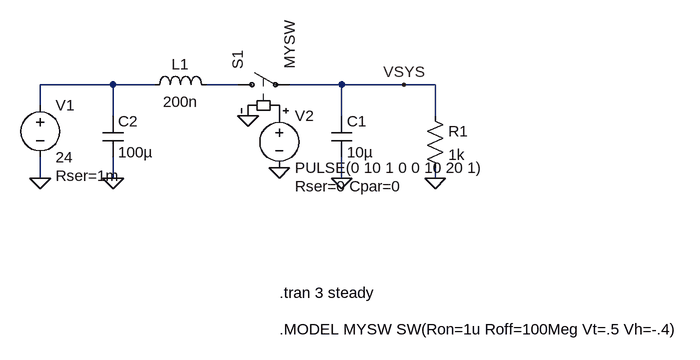
[diagram p0: schematic Draft1.asc]
Draft1.asc, the LTspice schematic file:
Version 4
SHEET 1 896 680
WIRE -16 112 -128 112
WIRE 48 112 -16 112
WIRE 176 112 128 112
WIRE 336 112 256 112
WIRE 432 112 336 112
WIRE 480 112 432 112
WIRE -128 144 -128 112
WIRE -16 160 -16 112
WIRE 336 160 336 112
WIRE 480 160 480 112
WIRE -128 256 -128 224
WIRE -16 256 -16 224
WIRE 336 256 336 224
WIRE 480 256 480 240
FLAG 336 256 0
FLAG -16 256 0
FLAG 480 256 0
FLAG -128 256 0
FLAG 192 160 0
FLAG 240 240 0
FLAG 432 112 VSYS
SYMBOL ind 32 128 R270
WINDOW 0 32 56 VTop 2
WINDOW 3 5 56 VBottom 2
SYMATTR InstName L1
SYMATTR Value 200n
SYMATTR SpiceLine Ipk=200 Rser=0.5m Rpar=0 Cpar=0
SYMBOL cap 320 160 R0
SYMATTR InstName C1
SYMATTR Value 10µ
SYMATTR SpiceLine V=25 Rser=1m
SYMBOL cap -32 160 R0
SYMATTR InstName C2
SYMATTR Value 100µ
SYMATTR SpiceLine V=25 Rser=1m
SYMBOL res 464 144 R0
SYMATTR InstName R1
SYMATTR Value 1k
SYMBOL voltage -128 128 R0
WINDOW 123 0 0 Left 0
WINDOW 39 24 124 Left 2
SYMATTR InstName V1
SYMATTR Value 24
SYMATTR SpiceLine Rser=1m
SYMBOL voltage 240 144 R0
WINDOW 123 0 0 Left 0
WINDOW 39 24 124 Left 2
SYMATTR InstName V2
SYMATTR Value PULSE(0 10 1 0 0 10 20 1)
SYMATTR SpiceLine Rser=0 Cpar=0
SYMBOL sw 160 112 R270
SYMATTR InstName S1
SYMATTR Value MYSW
TEXT 240 432 Left 2 !.tran 3 steady
TEXT 240 488 Left 2 !.MODEL MYSW SW(Ron=1u Roff=100Meg Vt=.5 Vh=-.4)

The netlist it stands for:
* Draft1.asc
L1 N001 N002 200n Ipk=200 Rser=0.5m Rpar=0 Cpar=0
C1 VSYS 0 10µ V=25 Rser=1m
C2 N001 0 100µ V=25 Rser=1m
R1 VSYS 0 1k
V1 N001 0 24 Rser=1m
V2 P001 0 PULSE(0 10 1 0 0 10 20 1) Rser=0 Cpar=0
S1 N002 VSYS P001 0 MYSW
.tran 3 steady
.MODEL MYSW SW(Ron=1u Roff=100Meg Vt=.5 Vh=-.4)
.backanno
.end